# Altium schematic sheet 08_BB_Processor.SchDoc: BB Processor (part 1 of 3)
size A3; Organization: Lime Microsystems; Address1: Surrey Tech Centre; Address2: Guildford GU2 7YG; Address3: Surrey; Address4: United Kingdom; Revision: v1.0; SheetNumber: 8; SheetTotal: 11
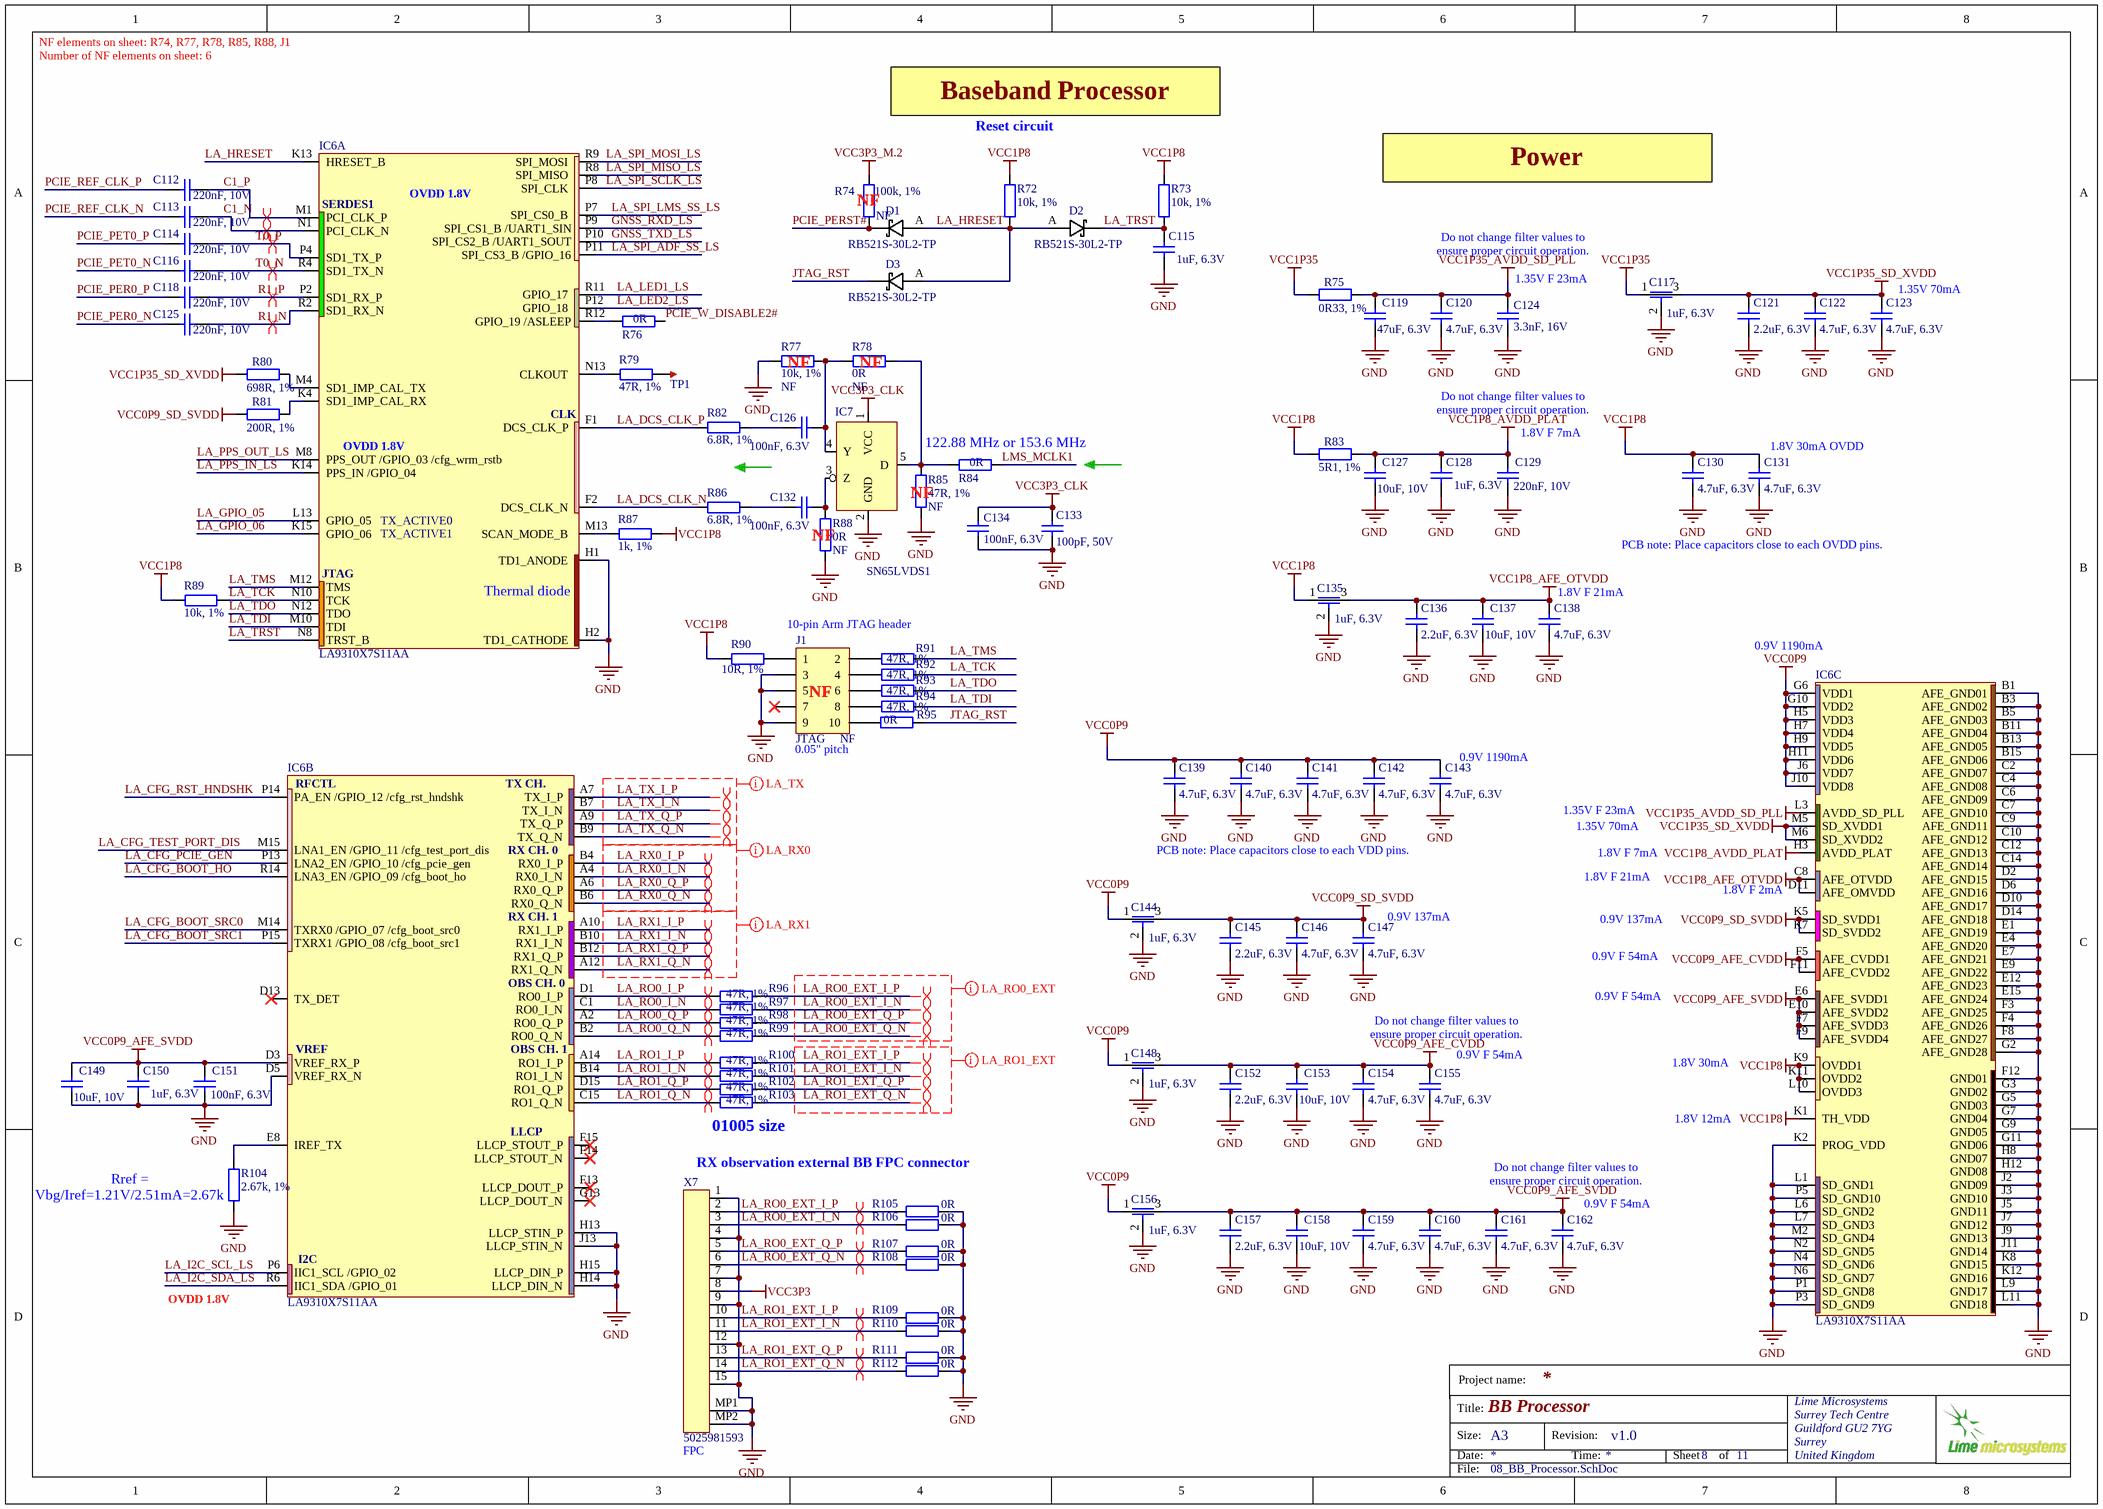
[diagram p0: 08_BB_Processor.SchDoc]

## Parts
C112  220nF, 10V  [CAP0201]
C113  220nF, 10V  [CAP0201]
C114  220nF, 10V  [CAP0201]
C115  1uF, 6.3V  [CAP0201]
C116  220nF, 10V  [CAP0201]
C117  1uF, 6.3V  [CAP0603_FEEDTHROUGH]
C118  220nF, 10V  [CAP0201]
C119  47uF, 6.3V  [CAP0603]
C120  4.7uF, 6.3V  [CAP0201]
C121  2.2uF, 6.3V  [CAP0201]
C122  4.7uF, 6.3V  [CAP0201]
C123  4.7uF, 6.3V  [CAP0201]
C124  3.3nF, 16V  [CAP0201]
C125  220nF, 10V  [CAP0201]
C126  100nF, 6.3V  [CAP0201]
C127  10uF, 10V  [CAP0402]
C128  1uF, 6.3V  [CAP0201]
C129  220nF, 10V  [CAP0201]
C130  4.7uF, 6.3V  [CAP0201]
C131  4.7uF, 6.3V  [CAP0201]
C132  100nF, 6.3V  [CAP0201]
C133  100pF, 50V  [CAP0201]
C134  100nF, 6.3V  [CAP0201]
C135  1uF, 6.3V  [CAP0603_FEEDTHROUGH]
C136  2.2uF, 6.3V  [CAP0201]
C137  10uF, 10V  [CAP0402]
C138  4.7uF, 6.3V  [CAP0201]
C139  4.7uF, 6.3V  [CAP0201]
C140  4.7uF, 6.3V  [CAP0201]
C141  4.7uF, 6.3V  [CAP0201]
C142  4.7uF, 6.3V  [CAP0201]
C143  4.7uF, 6.3V  [CAP0201]
C144  1uF, 6.3V  [CAP0603_FEEDTHROUGH]
C145  2.2uF, 6.3V  [CAP0201]
C146  4.7uF, 6.3V  [CAP0201]
C147  4.7uF, 6.3V  [CAP0201]
C148  1uF, 6.3V  [CAP0603_FEEDTHROUGH]
C149  10uF, 10V  [CAP0402]
C150  1uF, 6.3V  [CAP0201]
C151  100nF, 6.3V  [CAP0201]
C152  2.2uF, 6.3V  [CAP0201]
C153  10uF, 10V  [CAP0402]
C154  4.7uF, 6.3V  [CAP0201]
C155  4.7uF, 6.3V  [CAP0201]
C156  1uF, 6.3V  [CAP0603_FEEDTHROUGH]
C157  2.2uF, 6.3V  [CAP0201]
C158  10uF, 10V  [CAP0402]
C159  4.7uF, 6.3V  [CAP0201]
C160  4.7uF, 6.3V  [CAP0201]
C161  4.7uF, 6.3V  [CAP0201]
C162  4.7uF, 6.3V  [CAP0201]
D1  RB521S-30L2-TP  [RB521S-30L2-TP_DFN1006]
D2  RB521S-30L2-TP  [RB521S-30L2-TP_DFN1006]
D3  RB521S-30L2-TP  [RB521S-30L2-TP_DFN1006]
IC6  LA9310X7S11AA  [LA9310X7S11AA]  (parts A,B,C of 3)
IC7  SN65LVDS1  [SOT23-5_NO_SILK]
J1  JTAG  Assembly Info: NF  [HEADER_5x2_TH_HALF_PITCH]
R72  10k, 1%  [RES0201]
R73  10k, 1%  [RES0201]
R74  100k, 1%  Assembly Info: NF  [RES0201]
R75  0R33, 1%  [RES0201]
R76  0R  [RES0201]
R77  10k, 1%  Assembly Info: NF  [RES0201]
R78  0R  Assembly Info: NF  [RES0201]
R79  47R, 1%  [RES0201]
R80  698R, 1%  [RES0201]
R81  200R, 1%  [RES0201]
R82  6.8R, 1%  [RES0201]
R83  5R1, 1%  [RES0201]
R84  0R  [RES0201]
R85  47R, 1%  Assembly Info: NF  [RES0201]
R86  6.8R, 1%  [RES0201]
R87  1k, 1%  [RES0201]
R88  0R  Assembly Info: NF  [RES0201]
R89  10k, 1%  [RES0201]
R90  10R, 1%  [RES0201]
R91  47R, 1%  [RES0201]
R92  47R, 1%  [RES0201]
R93  47R, 1%  [RES0201]
R94  47R, 1%  [RES0201]
R95  0R  [RES0201]
R96  47R, 1%  [RES01005]
R97  47R, 1%  [RES01005]
R98  47R, 1%  [RES01005]
R99  47R, 1%  [RES01005]
R100  47R, 1%  [RES01005]
R101  47R, 1%  [RES01005]
R102  47R, 1%  [RES01005]
R103  47R, 1%  [RES01005]
R104  2.67k, 1%  [RES0201]
R105  0R  [RES01005]
R106  0R  [RES01005]
R107  0R  [RES01005]
R108  0R  [RES01005]
R109  0R  [RES01005]
R110  0R  [RES01005]
R111  0R  [RES01005]
R112  0R  [RES01005]
TP1  TESTPOINT_PAD  [TP_PAD_1MM]  (value not drawn)  (no BOM)
X7  5025981593  [5025981593_FPC_connector]

## Nets
GND: C115.2 C117.2 C119.1 C120.1 C121.1 C122.1 C123.1 C124.2 C127.1 C128.2 C129.2 C130.1 C131.1 C133.1 C134.2 C135.2 C136.1 C137.1 C138.1 C139.1 C140.1 C141.1 C142.1 C143.1 C144.2 C145.1 C146.1 C147.1 C148.2 C149.1 C150.2 C151.2 C152.1 C153.1 C154.1 C155.1 C156.2 C157.1 C158.1 C159.1 C160.1 C161.1 C162.1 IC6.B1(AFE_GND01) IC6.B3(AFE_GND02) IC6.B5(AFE_GND03) IC6.B11(AFE_GND04) IC6.B13(AFE_GND05) IC6.B15(AFE_GND06) IC6.C2(AFE_GND07) IC6.C4(AFE_GND08) IC6.C6(AFE_GND09) IC6.C7(AFE_GND10) IC6.C9(AFE_GND11) IC6.C10(AFE_GND12) IC6.C12(AFE_GND13) IC6.C14(AFE_GND14) IC6.D2(AFE_GND15) IC6.D5(VREF_RX_N) IC6.D6(AFE_GND16) IC6.D10(AFE_GND17) IC6.D14(AFE_GND18) IC6.E1(AFE_GND19) IC6.E4(AFE_GND20) IC6.E7(AFE_GND21) IC6.E9(AFE_GND22) IC6.E12(AFE_GND23) IC6.E15(AFE_GND24) IC6.F3(AFE_GND25) IC6.F4(AFE_GND26) IC6.F8(AFE_GND27) IC6.F12(GND01) IC6.G2(AFE_GND28) IC6.G3(GND02) IC6.G5(GND03) IC6.G7(GND04) IC6.G9(GND05) IC6.G11(GND06) IC6.H1(TD1_ANODE) IC6.H2(TD1_CATHODE) IC6.H8(GND07) IC6.H12(GND08) IC6.H13(LLCP_STIN_P) IC6.H14(LLCP_DIN_N) IC6.H15(LLCP_DIN_P) IC6.J2(GND09) IC6.J3(GND10) IC6.J5(GND11) IC6.J7(GND12) IC6.J9(GND13) IC6.J11(GND14) IC6.J13(LLCP_STIN_N) IC6.K2(PROG_VDD) IC6.K8(GND15) IC6.K12(GND16) IC6.L1(SD_GND1) IC6.L6(SD_GND2) IC6.L7(SD_GND3) IC6.L9(GND17) IC6.L11(GND18) IC6.M2(SD_GND4) IC6.N2(SD_GND5) IC6.N4(SD_GND6) IC6.N6(SD_GND7) IC6.P1(SD_GND8) IC6.P3(SD_GND9) IC6.P5(SD_GND10) IC7.2(GND) J1.3 J1.5 J1.9 R77.1 R85.2 R88.1 R104.2 R105.2 R106.2 R107.2 R108.2 R109.2 R110.2 R111.2 R112.2 X7.1 X7.4 X7.7 X7.9 X7.12 X7.15 X7.MP1 X7.MP2
VCC0P9: C139.2 C140.2 C141.2 C142.2 C143.2 C144.1 C148.1 C156.1 IC6.G6(VDD1) IC6.G10(VDD2) IC6.H5(VDD3) IC6.H7(VDD4) IC6.H9(VDD5) IC6.H11(VDD6) IC6.J6(VDD7) IC6.J10(VDD8)
VCC0P9_AFE_CVDD: C148.3 C152.2 C153.2 C154.2 C155.2 IC6.F5(AFE_CVDD1) IC6.F11(AFE_CVDD2)
VCC0P9_AFE_SVDD: C149.2 C150.1 C151.1 C156.3 C157.2 C158.2 C159.2 C160.2 C161.2 C162.2 IC6.D3(VREF_RX_P) IC6.E6(AFE_SVDD1) IC6.E10(AFE_SVDD2) IC6.F7(AFE_SVDD3) IC6.F9(AFE_SVDD4)
VCC0P9_SD_SVDD: C144.3 C145.2 C146.2 C147.2 IC6.K5(SD_SVDD1) IC6.K7(SD_SVDD2) R81.2
VCC1P8: C130.2 C131.2 C135.1 IC6.K1(TH_VDD) IC6.K9(OVDD1) IC6.K11(OVDD2) IC6.L10(OVDD3) R72.1 R73.1 R83.2 R87.2 R89.1 R90.2
VCC1P8_AFE_OTVDD: C135.3 C136.2 C137.2 C138.2 IC6.C8(AFE_OTVDD) IC6.D11(AFE_OMVDD)
VCC1P8_AVDD_PLAT: C127.2 C128.1 C129.1 IC6.H3(AVDD_PLAT) R83.1
VCC1P35: C117.1 R75.2
VCC1P35_AVDD_SD_PLL: C119.2 C120.2 C124.1 IC6.L3(AVDD_SD_PLL) R75.1
VCC1P35_SD_XVDD: C117.3 C121.2 C122.2 C123.2 IC6.M5(SD_XVDD1) IC6.M6(SD_XVDD2) R80.2
VCC3P3: X7.8
VCC3P3_CLK: C133.2 C134.1 IC7.1(VCC)
VCC3P3_M.2: R74.1
C1_N: C113.2 IC6.N1(PCI_CLK_N)
C1_P: C112.2 IC6.M1(PCI_CLK_P)
GNSS_RXD_LS: IC6.P9(SPI_CS1_B_/UART1_SIN)
GNSS_TXD_LS: IC6.P10(SPI_CS2_B_/UART1_SOUT)
JTAG_RST: D3.C R95.2
LA_CFG_BOOT_HO: IC6.R14(LNA3_EN_/GPIO_09_/cfg_boot_ho)
LA_CFG_BOOT_SRC0: IC6.M14(TXRX0_/GPIO_07_/cfg_boot_src0)
LA_CFG_BOOT_SRC1: IC6.P15(TXRX1_/GPIO_08_/cfg_boot_src1)
LA_CFG_PCIE_GEN: IC6.P13(LNA2_EN_/GPIO_10_/cfg_pcie_gen)
LA_CFG_RST_HNDSHK: IC6.P14(PA_EN_/GPIO_12_/cfg_rst_hndshk)
LA_CFG_TEST_PORT_DIS: IC6.M15(LNA1_EN_/GPIO_11_/cfg_test_port_dis)
LA_DCS_CLK_N: IC6.F2(DCS_CLK_N) R86.2
LA_DCS_CLK_P: IC6.F1(DCS_CLK_P) R82.2
LA_GPIO_05: IC6.L13(GPIO_05)
LA_GPIO_06: IC6.K15(GPIO_06)
LA_HRESET: D1.A D2.A D3.A IC6.K13(HRESET_B) R72.2
LA_I2C_SCL_LS: IC6.P6(IIC1_SCL_/GPIO_02)
LA_I2C_SDA_LS: IC6.R6(IIC1_SDA_/GPIO_01)
LA_LED1_LS: IC6.R11(GPIO_17)
LA_LED2_LS: IC6.P12(GPIO_18)
LA_PPS_IN_LS: IC6.K14(PPS_IN_/GPIO_04)
LA_PPS_OUT_LS: IC6.M8(PPS_OUT_/GPIO_03_/cfg_wrm_rstb)
LA_RO0_EXT_I_N: R97.2 R106.1 X7.3
LA_RO0_EXT_I_P: R96.2 R105.1 X7.2
LA_RO0_EXT_Q_N: R99.2 R108.1 X7.6
LA_RO0_EXT_Q_P: R98.2 R107.1 X7.5
LA_RO0_I_N: IC6.C1(RO0_I_N) R97.1
LA_RO0_I_P: IC6.D1(RO0_I_P) R96.1
LA_RO0_Q_N: IC6.B2(RO0_Q_N) R99.1
LA_RO0_Q_P: IC6.A2(RO0_Q_P) R98.1
LA_RO1_EXT_I_N: R101.2 R110.1 X7.11
LA_RO1_EXT_I_P: R100.2 R109.1 X7.10
LA_RO1_EXT_Q_N: R103.2 R112.1 X7.14
LA_RO1_EXT_Q_P: R102.2 R111.1 X7.13
LA_RO1_I_N: IC6.B14(RO1_I_N) R101.1
LA_RO1_I_P: IC6.A14(RO1_I_P) R100.1
LA_RO1_Q_N: IC6.C15(RO1_Q_N) R103.1
LA_RO1_Q_P: IC6.D15(RO1_Q_P) R102.1
LA_RX0_I_N: IC6.A4(RX0_I_N)
LA_RX0_I_P: IC6.B4(RX0_I_P)
LA_RX0_Q_N: IC6.B6(RX0_Q_N)
LA_RX0_Q_P: IC6.A6(RX0_Q_P)
LA_RX1_I_N: IC6.B10(RX1_I_N)
LA_RX1_I_P: IC6.A10(RX1_I_P)
LA_RX1_Q_N: IC6.A12(RX1_Q_N)
LA_RX1_Q_P: IC6.B12(RX1_Q_P)
LA_SPI_ADF_SS_LS: IC6.P11(SPI_CS3_B_/GPIO_16)
LA_SPI_LMS_SS_LS: IC6.P7(SPI_CS0_B)
LA_SPI_MISO_LS: IC6.R8(SPI_MISO)
LA_SPI_MOSI_LS: IC6.R9(SPI_MOSI)
LA_SPI_SCLK_LS: IC6.P8(SPI_CLK)
LA_TCK: IC6.N10(TCK) R89.2 R92.1
LA_TDI: IC6.M10(TDI) R94.1
LA_TDO: IC6.N12(TDO) R93.1
LA_TMS: IC6.M12(TMS) R91.1
LA_TRST: C115.1 D2.C IC6.N8(TRST_B) R73.2
LA_TX_I_N: IC6.B7(TX_I_N)
LA_TX_I_P: IC6.A7(TX_I_P)
LA_TX_Q_N: IC6.B9(TX_Q_N)
LA_TX_Q_P: IC6.A9(TX_Q_P)
LMS_MCLK1: R84.1
PCIE_PER0_N: C125.1
PCIE_PER0_P: C118.1
PCIE_PERST#: D1.C R74.2
PCIE_PET0_N: C116.1
PCIE_PET0_P: C114.1
PCIE_REF_CLK_N: C113.1
PCIE_REF_CLK_P: C112.1
PCIE_W_DISABLE2#: R76.1
R1_N: C125.2 IC6.R2(SD1_RX_N)
R1_P: C118.2 IC6.P2(SD1_RX_P)
T0_N: C116.2 IC6.R4(SD1_TX_N)
T0_P: C114.2 IC6.P4(SD1_TX_P)
NetC126_1: C126.1 R82.1
NetC126_2: C126.2 IC7.4(Y) R77.2 R78.2
NetC132_1: C132.1 R86.1
NetC132_2: C132.2 IC7.3(Z) R88.2
NetIC6_E8: IC6.E8(IREF_TX) R104.1
NetIC6_K4: IC6.K4(SD1_IMP_CAL_RX) R81.1
NetIC6_M4: IC6.M4(SD1_IMP_CAL_TX) R80.1
NetIC6_M13: IC6.M13(SCAN_MODE_B) R87.1
NetIC6_N13: IC6.N13(CLKOUT) R79.2
NetIC6_R12: IC6.R12(GPIO_19_/ASLEEP) R76.2
NetIC7_5: IC7.5(D) R78.1 R84.2 R85.1
NetJ1_1: J1.1 R90.1
NetJ1_2: J1.2 R91.2
NetJ1_4: J1.4 R92.2
NetJ1_6: J1.6 R93.2
NetJ1_8: J1.8 R94.2
NetJ1_10: J1.10 R95.1
NetR79_1: R79.1 TP1.1

Not connected (* = marked no-connect by the designer): IC6 D13(TX_DET_)* F13(LLCP_DOUT_P_)* F14(LLCP_STOUT_N_)* F15(LLCP_STOUT_P_)* G13(LLCP_DOUT_N_)*; J1 7*

## Layout directives
differential pair: C1_N, C1_P, LA_RO0_EXT_I_N, LA_RO0_EXT_I_P, LA_RO0_EXT_Q_N, LA_RO0_EXT_Q_P, LA_RO0_I_N, LA_RO0_I_P, LA_RO0_Q_N, LA_RO0_Q_P, LA_RO1_EXT_I_N, LA_RO1_EXT_I_P, LA_RO1_EXT_Q_N, LA_RO1_EXT_Q_P, LA_RO1_I_N, LA_RO1_I_P, LA_RO1_Q_N, LA_RO1_Q_P, LA_RX0_I_N, LA_RX0_I_P, LA_RX0_Q_N, LA_RX0_Q_P, LA_RX1_I_N, LA_RX1_I_P, LA_RX1_Q_N, LA_RX1_Q_P, LA_TX_I_N, LA_TX_I_P, LA_TX_Q_N, LA_TX_Q_P, R1_N, R1_P, T0_N, T0_P
net class LA_RX0: LA_RX0_I_N, LA_RX0_I_P, LA_RX0_Q_N, LA_RX0_Q_P
net class LA_RX1: LA_RX1_I_N, LA_RX1_I_P, LA_RX1_Q_N, LA_RX1_Q_P
net class LA_TX: LA_TX_I_N, LA_TX_I_P, LA_TX_Q_N, LA_TX_Q_P
net class LA_RO0_EXT: LA_RO0_EXT_I_N, LA_RO0_EXT_I_P, LA_RO0_EXT_Q_N, LA_RO0_EXT_Q_P
net class LA_RO1_EXT: LA_RO1_EXT_I_N, LA_RO1_EXT_I_P, LA_RO1_EXT_Q_N, LA_RO1_EXT_Q_P

## Notes on the sheet
- NF elements on sheet: R74, R77, R78, R85, R88, J1
- Number of NF elements on sheet: 6
- Baseband Processor
- (near R72) Reset circuit
- Power
- (near IC6) OVDD 1.8V
- (near R74) NF
- Do not change filter values to ensure proper circuit operation.
- (near C124) 1.35V F 23mA
- (near C123) 1.35V 70mA
- (near R77) NF
- (near R78) NF
- (near R84) 122.88 MHz or 153.6 MHz
- (near C129) 1.8V F 7mA
- (near C131) 1.8V 30mA OVDD
- NF
- (near R88) NF
- PCB note: Place capacitors close to each OVDD pins.
- (near IC6) Thermal diode
- 10-pin Arm JTAG header
- (near C138) 1.8V F 21mA
- (near IC6) 0.9V 1190mA
- (near J1) NF
- 0.05" pitch
- (near C143) 0.9V 1190mA
- PCB note: Place capacitors close to each VDD pins.
- 1.35V F 23mA
- 1.35V 70mA
- 1.8V F 7mA
- (near C147) 0.9V 137mA
- 1.8V F 21mA
- 0.9V 137mA
- (near IC6) 1.8V F 2mA
- 0.9V F 54mA
- (near C155) 0.9V F 54mA
- (near R103) 01005 size
- 1.8V 30mA
- 1.8V 12mA
- RX observation external BB FPC connector
- (near R104) Rref = Vbg/Iref=1.21V/2.51mA=2.67k
- (near C162) 0.9V F 54mA
- OVDD 1.8V
- (near X7) FPC
- Project name:
- Title:
- Size:
- Date:
- A3
- Revision:
- Time:
- Sheet
- of
- File:
- (in symbol LA9310X7S11AA, part A) SERDES1; CLK; TX_ACTIVE0; TX_ACTIVE1; JTAG
- (in symbol LA9310X7S11AA, part B) RFCTL; TX CH.; RX CH. 0; RX CH. 1; OBS CH. 0; VREF; OBS CH. 1; LLCP; I2C